# Altium schematic sheet Top.SchDoc
size A; SheetNumber: 1; SheetTotal: 6
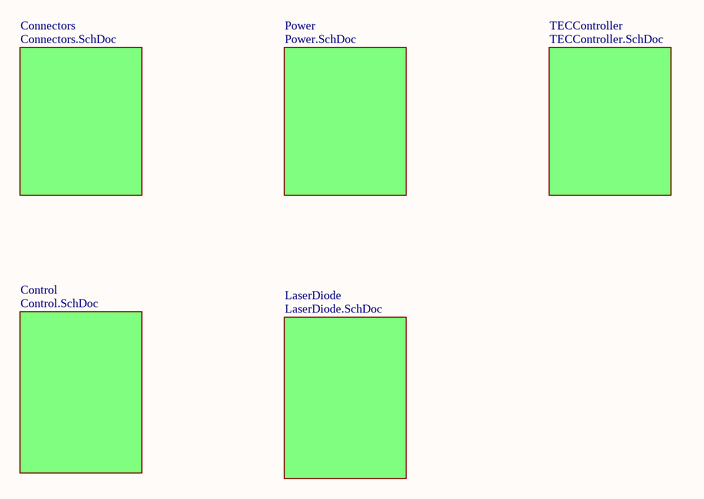
[diagram p0: Top.SchDoc]

## Sub-sheets
Connectors = Connectors.SchDoc: no entries
Control = Control.SchDoc: no entries
LaserDiode = LaserDiode.SchDoc: no entries
Power = Power.SchDoc: no entries
TECController = TECController.SchDoc: no entries